# Altium schematic sheet RS485_RGB_Power.SchDoc
size A4; Organization: Altium Limited; Address1: L3, 12a Rodborough Rd; Address2: Frenchs Forest; Address3: NSW; Address4: Australia 2086
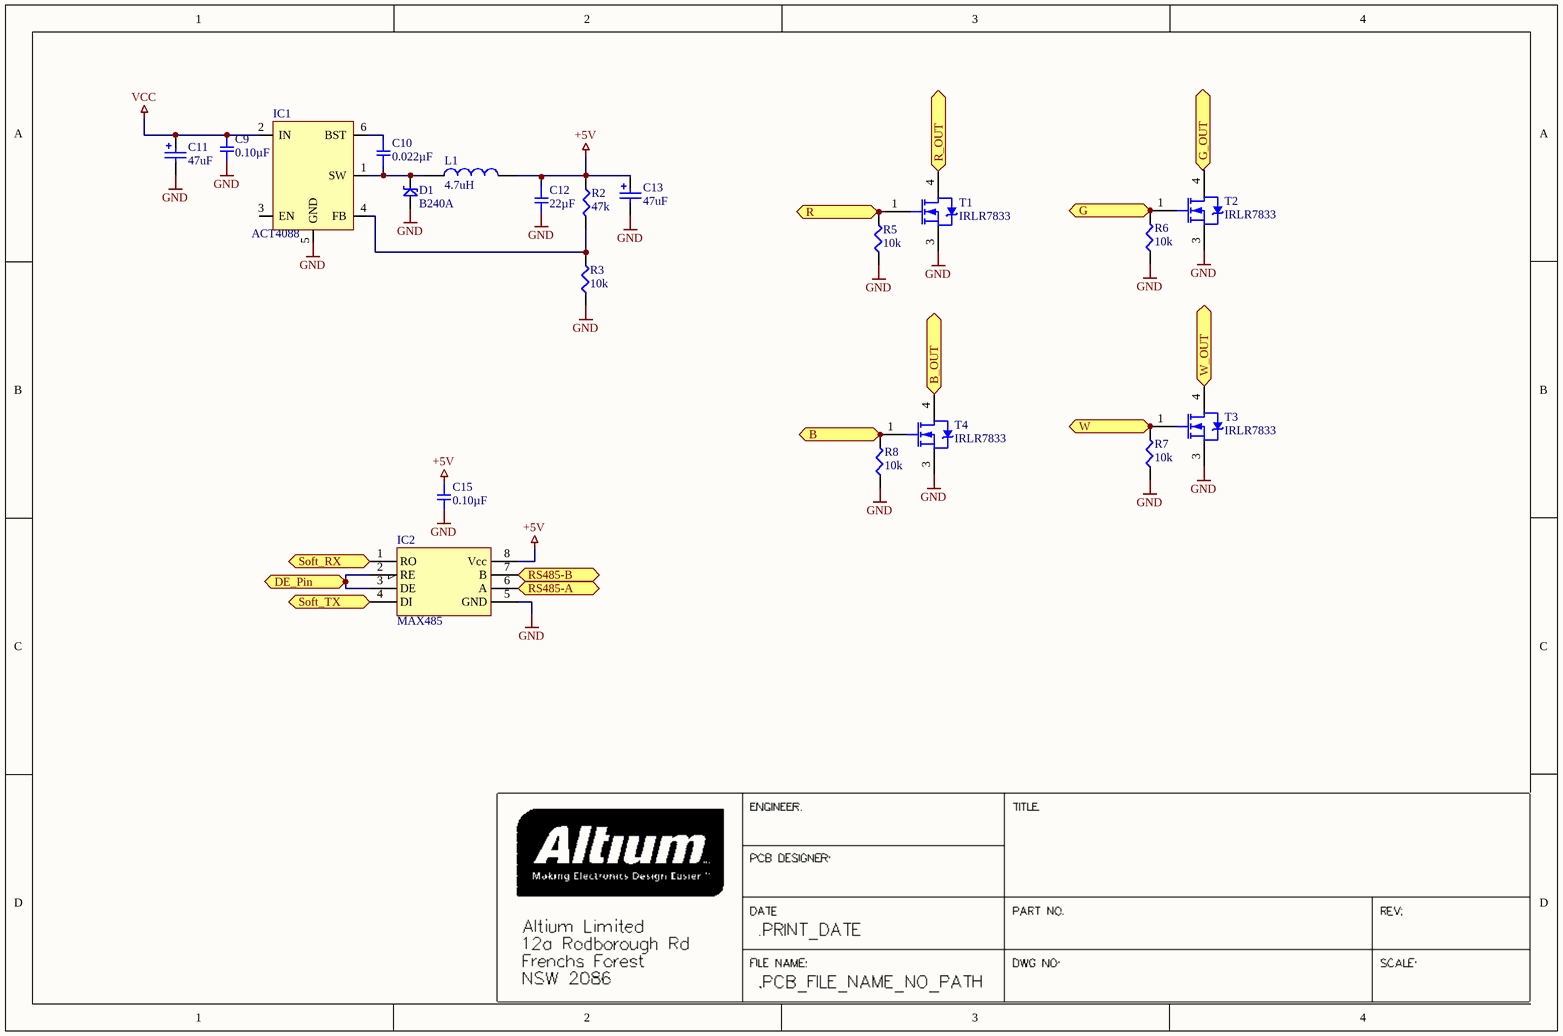
[diagram p0: RS485_RGB_Power.SchDoc]

## Parts
C9  0.10µF  [SMD-0603C]
C10  0.022µF  [SMD-0603C]
C11  value 47uF  [WCAP-ASLI_6.3x5.5]  (hidden comment: 865080543009)
C12  22µF  [SMD-0603C]
C13  value 47uF  [WCAP-ASLI_6.3x5.5]  (hidden comment: 865080543009)
C15  0.10µF  [SMD-0603C]
D1  B240A  [B240A]
IC1  ACT4088  [SOT23-6]
IC2  MAX485  [D008_L]
L1  value 4.7uH  [WE-TPC_2813]  (hidden comment: 744029004)
R2  47k  [SMD-0603-RES]
R3  10k  [SMD-0603-RES]
R5  10k  [SMD-0603-RES]
R6  10k  [SMD-0603-RES]
R7  10k  [SMD-0603-RES]
R8  10k  [SMD-0603-RES]
T1  IRLR7833  [ONSC-DPAK-3-369C-01_V]
T2  IRLR7833  [ONSC-DPAK-3-369C-01_V]
T3  IRLR7833  [ONSC-DPAK-3-369C-01_V]
T4  IRLR7833  [ONSC-DPAK-3-369C-01_V]

## Ports
B, B_OUT, DE_Pin, G, G_OUT, R, R_OUT, RS485-A, RS485-B, Soft_RX, Soft_TX, W, W_OUT

## Nets
+5V: C12.1 C13.1(P) C15.1 IC2.8(Vcc) L1.2 R2.1
GND: C9.2 C11.2(N) C12.2 C13.2(N) C15.2 D1.A IC1.5(GND) IC2.5(GND) R3.1 R5.1 R6.1 R7.1 R8.1 T1.3(S) T2.3(S) T3.3(S) T4.3(S)
VCC: C9.1 C11.1(P) IC1.2(IN)
B: R8.2 T4.1(G) ; port B
B_OUT: T4.4(D) ; port B_OUT
DE_Pin: IC2.2(RE) IC2.3(DE) ; port DE_Pin
G: R6.2 T2.1(G) ; port G
G_OUT: T2.4(D) ; port G_OUT
R: R5.2 T1.1(G) ; port R
R_OUT: T1.4(D) ; port R_OUT
RS485-A: IC2.6(A) ; port RS485-A
RS485-B: IC2.7(B) ; port RS485-B
Soft_RX: IC2.1(RO) ; port Soft_RX
Soft_TX: IC2.4(DI) ; port Soft_TX
W: R7.2 T3.1(G) ; port W
W_OUT: T3.4(D) ; port W_OUT
NetC10_1: C10.1 IC1.6(BST)
NetC10_2: C10.2 D1.K IC1.1(SW) L1.1
NetIC1_4: IC1.4(FB) R2.2 R3.2

Not connected (* = marked no-connect by the designer): IC1 3(EN)

## Library data of the parts
C9 C15 = GCJ188R72A104KA01D: CAP CER 0.1UF 100V X7R 0603; Manufacturer: Murata Electronics North America; Factory Stock: 0; Unit Price (USD): 0.23; Minimum Quantity: 1; Tolerance: ±10%; Datasheets: http://www.murata.com/~/media/webrenewal/support/library/catalog/products/capacitor/mlcc/c03e.ashx; Image: //media.digikey.com/Renders/Murata%20Renders/0603%28LQG18%29.jpg; Digi-Key Part Number: 490-13420-1-ND; Part Number: GCJ188R72A104KA01D; Quantity Available: 2728; @ qty: 0; Packaging: Cut Tape (CT); Series: GCJ; Part Status: Active; Value: 0.10µF; Voltage: 100V; Temperature Coefficient: X7R; Operating Temperature: -55°C ~ 125°C; Features: Soft Termination; Ratings: AEC-Q200; Applications: Automotive, Boardflex Sensitive; Mounting Type: Surface Mount, MLCC; Package / Case: 0603 (1608 Metric); Size / Dimension: 0.063" L x 0.031" W (1.60mm x 0.80mm); Height - Seated (Max): -; Thickness (Max): 0.035" (0.90mm); Lead Spacing: -; Lead Style: -
C10 = GCJ188R71H223KA01D: CAP CER 0.022UF 50V X7R 0603; Manufacturer: Murata Electronics North America; Factory Stock: 0; Unit Price (USD): 0.22; Minimum Quantity: 1; Tolerance: ±10%; Datasheets: http://www.murata.com/~/media/webrenewal/support/library/catalog/products/capacitor/mlcc/c03e.ashx; Image: //media.digikey.com/Renders/Murata%20Renders/0603%28LQG18%29.jpg; Digi-Key Part Number: 490-5851-1-ND; Part Number: GCJ188R71H223KA01D; Quantity Available: 7651; @ qty: 0; Packaging: Cut Tape (CT); Series: GCJ; Part Status: Active; Value: 0.022µF; Voltage: 50V; Temperature Coefficient: X7R; Operating Temperature: -55°C ~ 125°C; Features: Soft Termination; Ratings: AEC-Q200; Applications: Automotive, Boardflex Sensitive; Mounting Type: Surface Mount, MLCC; Package / Case: 0603 (1608 Metric); Size / Dimension: 0.063" L x 0.031" W (1.60mm x 0.80mm); Height - Seated (Max): -; Thickness (Max): 0.031" (0.80mm); Lead Spacing: -; Lead Style: -
C11 C13 = 865080543009: WCAP-ASLI Aluminum Electrolytic Capacitors, size Ф6.3x5.5mm, 35V DC, 47uF; Rated Voltage: 35V DC; ComponentLink1Description: Manufacturer; ComponentLink1URL: http://www.we-online.de; ComponentLink2Description: Datasheet; ComponentLink2URL: http://katalog.we-online.de/pbs/datasheet/865080543009.pdf; Part Number: 865080543009; Published Date: June 2017; Publisher: Wurth Elektronik; Size: Ф6.3x5.5mm; Life Cycle: 2000h; Operating Temperature: -55 °C up to +105 °C
C12 = GRM186R60G226ME15D: CAP CER 22UF 4V X5R 0603; Manufacturer: Murata Electronics North America; Factory Stock: 0; Unit Price (USD): 0.32; Minimum Quantity: 1; Tolerance: ±20%; Datasheets: http://psearch.en.murata.com/capacitor/product/GRM186R60G226ME15%23.pdf; Image: //media.digikey.com/Renders/Murata%20Renders/ZRB-SERIES-0402.jpg; Digi-Key Part Number: 490-13240-1-ND; Part Number: GRM186R60G226ME15D; Quantity Available: 3630; @ qty: 0; Packaging: Cut Tape (CT); Series: GRM; Part Status: Active; Value: 22µF; Voltage: 4V; Temperature Coefficient: X5R; Operating Temperature: -55°C ~ 85°C; Features: -; Ratings: -; Applications: General Purpose; Mounting Type: Surface Mount, MLCC; Package / Case: 0603 (1608 Metric); Size / Dimension: 0.063" L x 0.031" W (1.60mm x 0.80mm); Height - Seated (Max): -; Thickness (Max): 0.028" (0.70mm); Lead Spacing: -; Lead Style: -
D1 = B240A: Shottkydiode
L1 = 744029004: WE-TPC SMD Shielded Tiny Power Inductor, size 2813, 1A, 170mΩ, 4.7uH; ComponentLink1Description: Manufacturer; ComponentLink1URL: http://www.we-online.de; ComponentLink2Description: Datasheet; ComponentLink2URL: http://katalog.we-online.de/pbs/datasheet/744029004.pdf; Part Number: 744029004; Published Date: July 2017; Publisher: Wurth Elektronik; Rated Current: 1A; Size: 2813; DC Resistance: 170mΩ
R2 = ERJ-3EKF4702V: RES SMD 47K OHM 1% 1/10W 0603; Manufacturer: Panasonic Electronic Components; Factory Stock: 0; Unit Price (USD): 0.00379; @ qty: 1500; Minimum Quantity: 1; Power (Watts): 0.1W, 1/10W; Temperature Coefficient: ±100ppm/°C; Part Number: ERJ-3EKF4702V; Datasheets: http://industrial.panasonic.com/www-cgi/jvcr13pz.cgi?E+PZ+3+AOA0002+ERJ3EKF4702V+7+WW; Image: //media.digikey.com/Photos/Panasonic%20Photos/MFG_ERJ-P6W%20Series.jpg; Digi-Key Part Number: P47.0KHCT-ND; Quantity Available: 3596527; Packaging: Cut Tape (CT); Series: ERJ; Part Status: Active; Value: 47k; Tolerance: ±1%; Composition: Thick Film; Features: Automotive AEC-Q200; Operating Temperature: -55°C ~ 155°C; Package / Case: 0603 (1608 Metric); Supplier Device Package: 0603; Size / Dimension: 0.063" L x 0.031" W (1.60mm x 0.80mm); Height - Seated (Max): 0.022" (0.55mm); Number of Terminations: 2; Failure Rate: -
R3 R5-R8 = ERJ-3EKF1002V: RES SMD 10K OHM 1% 1/10W 0603; Manufacturer: Panasonic Electronic Components; Factory Stock: 0; Unit Price (USD): 0.00379; @ qty: 1500; Minimum Quantity: 1; Power (Watts): 0.1W, 1/10W; Temperature Coefficient: ±100ppm/°C; Part Number: ERJ-3EKF1002V; Datasheets: http://industrial.panasonic.com/www-cgi/jvcr13pz.cgi?E+PZ+3+AOA0002+ERJ3EKF1002V+7+WW; Image: //media.digikey.com/Photos/Panasonic%20Photos/MFG_ERJ-P6W%20Series.jpg; Digi-Key Part Number: P10.0KHCT-ND; Quantity Available: 6703141; Packaging: Cut Tape (CT); Series: ERJ; Part Status: Active; Value: 10k; Tolerance: ±1%; Composition: Thick Film; Features: Automotive AEC-Q200; Operating Temperature: -55°C ~ 155°C; Package / Case: 0603 (1608 Metric); Supplier Device Package: 0603; Size / Dimension: 0.063" L x 0.031" W (1.60mm x 0.80mm); Height - Seated (Max): 0.022" (0.55mm); Number of Terminations: 2; Failure Rate: -
T1-T4 = IRLR7833: N-Channel MOSFET